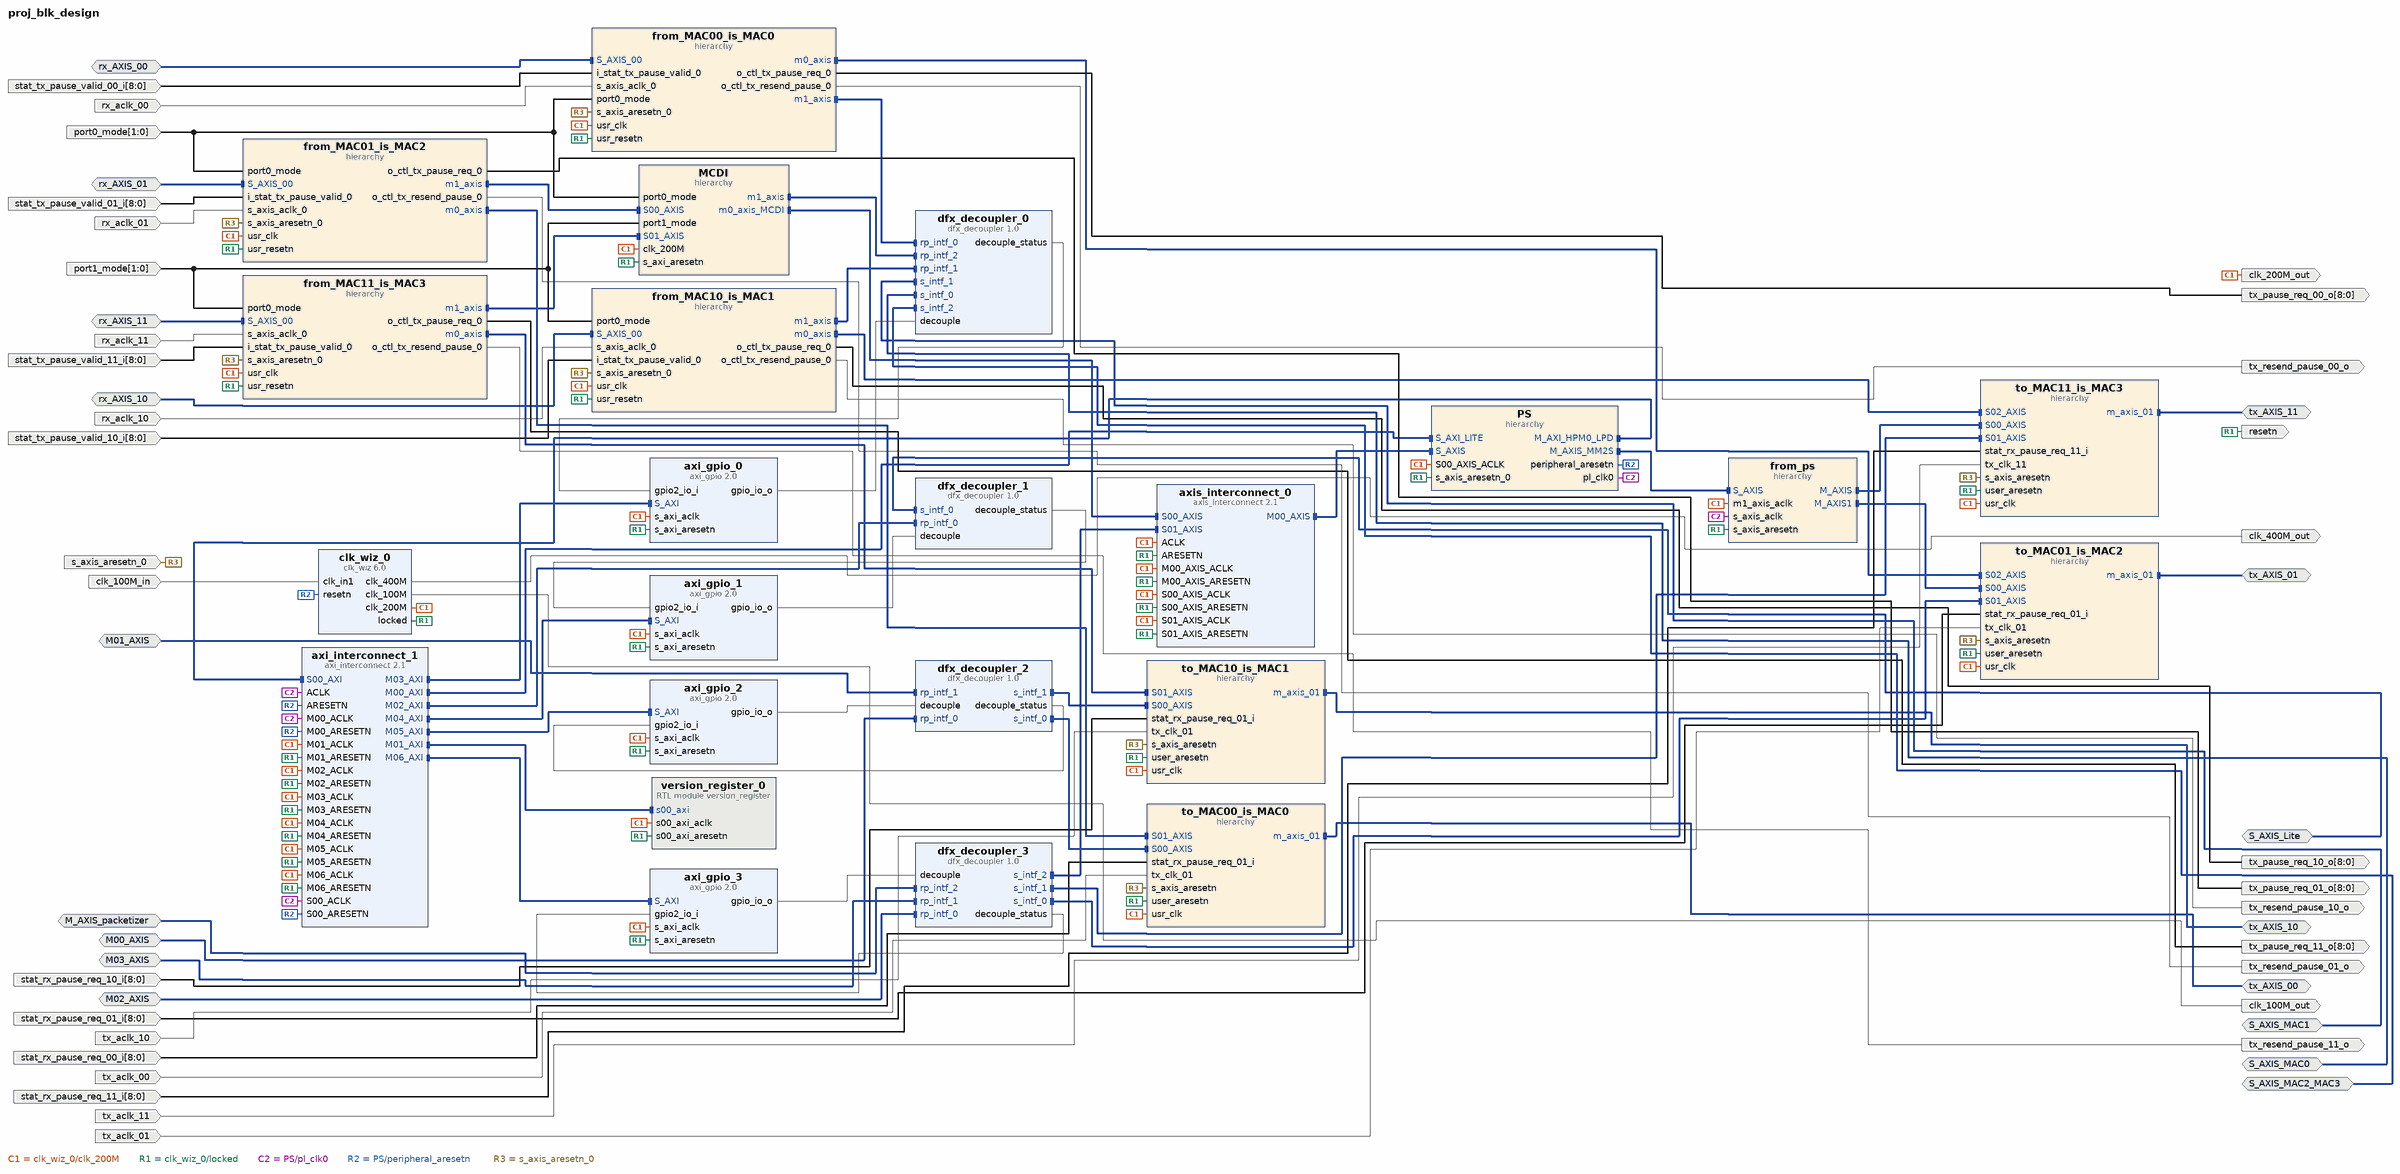
[diagram p0: block diagram of the top level]
# Vivado block design proj_blk_design, xcu25-ffvc1760-2LV-e, Vivado 2020.1_AR75245
create_bd_design proj_blk_design

create_bd_intf_port -mode Slave -vlnv xilinx.com:interface:axis_rtl:1.0 rx_AXIS_00
set_property -dict [list \
  CONFIG.TDATA_NUM_BYTES 8 \
  CONFIG.TDEST_WIDTH 0 \
  CONFIG.TID_WIDTH 0 \
  CONFIG.TUSER_WIDTH 0 \
  CONFIG.HAS_TREADY 1 \
  CONFIG.HAS_TSTRB 0 \
  CONFIG.HAS_TKEEP 1 \
  CONFIG.HAS_TLAST 1 \
  CONFIG.LAYERED_METADATA undef \
] [get_bd_intf_ports rx_AXIS_00]
create_bd_intf_port -mode Slave -vlnv xilinx.com:interface:axis_rtl:1.0 rx_AXIS_01
set_property -dict [list \
  CONFIG.TDATA_NUM_BYTES 8 \
  CONFIG.TDEST_WIDTH 0 \
  CONFIG.TID_WIDTH 0 \
  CONFIG.TUSER_WIDTH 0 \
  CONFIG.HAS_TREADY 1 \
  CONFIG.HAS_TSTRB 0 \
  CONFIG.HAS_TKEEP 1 \
  CONFIG.HAS_TLAST 1 \
  CONFIG.LAYERED_METADATA undef \
] [get_bd_intf_ports rx_AXIS_01]
create_bd_intf_port -mode Slave -vlnv xilinx.com:interface:axis_rtl:1.0 rx_AXIS_10
set_property -dict [list \
  CONFIG.TDATA_NUM_BYTES 8 \
  CONFIG.TDEST_WIDTH 0 \
  CONFIG.TID_WIDTH 0 \
  CONFIG.TUSER_WIDTH 0 \
  CONFIG.HAS_TREADY 1 \
  CONFIG.HAS_TSTRB 0 \
  CONFIG.HAS_TKEEP 1 \
  CONFIG.HAS_TLAST 1 \
  CONFIG.LAYERED_METADATA undef \
] [get_bd_intf_ports rx_AXIS_10]
create_bd_intf_port -mode Slave -vlnv xilinx.com:interface:axis_rtl:1.0 rx_AXIS_11
set_property -dict [list \
  CONFIG.TDATA_NUM_BYTES 8 \
  CONFIG.TDEST_WIDTH 0 \
  CONFIG.TID_WIDTH 0 \
  CONFIG.TUSER_WIDTH 0 \
  CONFIG.HAS_TREADY 1 \
  CONFIG.HAS_TSTRB 0 \
  CONFIG.HAS_TKEEP 1 \
  CONFIG.HAS_TLAST 1 \
  CONFIG.LAYERED_METADATA undef \
] [get_bd_intf_ports rx_AXIS_11]
create_bd_intf_port -mode Master -vlnv xilinx.com:interface:axis_rtl:1.0 tx_AXIS_00
create_bd_intf_port -mode Master -vlnv xilinx.com:interface:axis_rtl:1.0 tx_AXIS_01
create_bd_intf_port -mode Master -vlnv xilinx.com:interface:axis_rtl:1.0 tx_AXIS_10
create_bd_intf_port -mode Master -vlnv xilinx.com:interface:axis_rtl:1.0 tx_AXIS_11
create_bd_intf_port -mode Master -vlnv xilinx.com:interface:axis_rtl:1.0 S_AXIS_MAC0
set_property -dict {CONFIG.FREQ_HZ 200000000 CONFIG.PHASE 0.0} [get_bd_intf_ports S_AXIS_MAC0]
create_bd_intf_port -mode Master -vlnv xilinx.com:interface:axis_rtl:1.0 S_AXIS_MAC1
set_property -dict {CONFIG.FREQ_HZ 200000000 CONFIG.PHASE 0.0} [get_bd_intf_ports S_AXIS_MAC1]
create_bd_intf_port -mode Master -vlnv xilinx.com:interface:axis_rtl:1.0 S_AXIS_MAC2_MAC3
set_property -dict {CONFIG.FREQ_HZ 200000000 CONFIG.PHASE 0.0} [get_bd_intf_ports S_AXIS_MAC2_MAC3]
create_bd_intf_port -mode Master -vlnv xilinx.com:interface:aximm_rtl:1.0 S_AXIS_Lite
set_property -dict [list \
  CONFIG.DATA_WIDTH 32 \
  CONFIG.PROTOCOL AXI4LITE \
  CONFIG.FREQ_HZ 200000000 \
  CONFIG.ADDR_WIDTH 40 \
  CONFIG.HAS_BURST 0 \
  CONFIG.HAS_LOCK 0 \
  CONFIG.HAS_CACHE 0 \
  CONFIG.PHASE 0.0 \
] [get_bd_intf_ports S_AXIS_Lite]
create_bd_intf_port -mode Slave -vlnv xilinx.com:interface:axis_rtl:1.0 M00_AXIS
set_property -dict [list \
  CONFIG.TDATA_NUM_BYTES 64 \
  CONFIG.TDEST_WIDTH 4 \
  CONFIG.TID_WIDTH 0 \
  CONFIG.TUSER_WIDTH 0 \
  CONFIG.HAS_TREADY 1 \
  CONFIG.HAS_TSTRB 0 \
  CONFIG.HAS_TKEEP 1 \
  CONFIG.HAS_TLAST 1 \
  CONFIG.FREQ_HZ 200000000 \
  CONFIG.LAYERED_METADATA undef \
] [get_bd_intf_ports M00_AXIS]
create_bd_intf_port -mode Slave -vlnv xilinx.com:interface:axis_rtl:1.0 M01_AXIS
set_property -dict [list \
  CONFIG.TDATA_NUM_BYTES 64 \
  CONFIG.TDEST_WIDTH 4 \
  CONFIG.TID_WIDTH 0 \
  CONFIG.TUSER_WIDTH 0 \
  CONFIG.HAS_TREADY 1 \
  CONFIG.HAS_TSTRB 0 \
  CONFIG.HAS_TKEEP 1 \
  CONFIG.HAS_TLAST 1 \
  CONFIG.FREQ_HZ 200000000 \
  CONFIG.LAYERED_METADATA undef \
] [get_bd_intf_ports M01_AXIS]
create_bd_intf_port -mode Slave -vlnv xilinx.com:interface:axis_rtl:1.0 M02_AXIS
set_property -dict [list \
  CONFIG.TDATA_NUM_BYTES 64 \
  CONFIG.TDEST_WIDTH 4 \
  CONFIG.TID_WIDTH 0 \
  CONFIG.TUSER_WIDTH 0 \
  CONFIG.HAS_TREADY 1 \
  CONFIG.HAS_TSTRB 0 \
  CONFIG.HAS_TKEEP 1 \
  CONFIG.HAS_TLAST 1 \
  CONFIG.FREQ_HZ 200000000 \
  CONFIG.LAYERED_METADATA undef \
] [get_bd_intf_ports M02_AXIS]
create_bd_intf_port -mode Slave -vlnv xilinx.com:interface:axis_rtl:1.0 M03_AXIS
set_property -dict [list \
  CONFIG.TDATA_NUM_BYTES 64 \
  CONFIG.TDEST_WIDTH 4 \
  CONFIG.TID_WIDTH 0 \
  CONFIG.TUSER_WIDTH 0 \
  CONFIG.HAS_TREADY 1 \
  CONFIG.HAS_TSTRB 0 \
  CONFIG.HAS_TKEEP 1 \
  CONFIG.HAS_TLAST 1 \
  CONFIG.FREQ_HZ 200000000 \
  CONFIG.LAYERED_METADATA undef \
] [get_bd_intf_ports M03_AXIS]
create_bd_intf_port -mode Slave -vlnv xilinx.com:interface:axis_rtl:1.0 M_AXIS_packetizer
set_property -dict [list \
  CONFIG.TDATA_NUM_BYTES 6 \
  CONFIG.TDEST_WIDTH 0 \
  CONFIG.TID_WIDTH 0 \
  CONFIG.TUSER_WIDTH 0 \
  CONFIG.HAS_TREADY 1 \
  CONFIG.HAS_TSTRB 0 \
  CONFIG.HAS_TKEEP 0 \
  CONFIG.HAS_TLAST 0 \
  CONFIG.FREQ_HZ 200000000 \
  CONFIG.LAYERED_METADATA undef \
] [get_bd_intf_ports M_AXIS_packetizer]
create_bd_port -dir I -type clk clk_100M_in
set_property -dict {CONFIG.FREQ_HZ 100000000} [get_bd_ports clk_100M_in]
create_bd_port -dir O -type clk clk_200M_out
set_property -dict {CONFIG.FREQ_HZ 200000000} [get_bd_ports clk_200M_out]
create_bd_port -dir O -type clk clk_400M_out
set_property -dict {CONFIG.FREQ_HZ 400000000} [get_bd_ports clk_400M_out]
create_bd_port -dir I -from 1 -to 0 port0_mode
create_bd_port -dir I -from 1 -to 0 port1_mode
create_bd_port -dir O resetn
create_bd_port -dir I -type clk rx_aclk_00
create_bd_port -dir I -type clk rx_aclk_01
create_bd_port -dir I -type clk rx_aclk_10
create_bd_port -dir I -type clk rx_aclk_11
create_bd_port -dir I -type rst s_axis_aresetn_0
create_bd_port -dir I -from 8 -to 0 stat_rx_pause_req_00_i
create_bd_port -dir I -from 8 -to 0 stat_rx_pause_req_01_i
create_bd_port -dir I -from 8 -to 0 stat_rx_pause_req_10_i
create_bd_port -dir I -from 8 -to 0 stat_rx_pause_req_11_i
create_bd_port -dir I -from 8 -to 0 stat_tx_pause_valid_00_i
create_bd_port -dir I -from 8 -to 0 stat_tx_pause_valid_01_i
create_bd_port -dir I -from 8 -to 0 stat_tx_pause_valid_10_i
create_bd_port -dir I -from 8 -to 0 stat_tx_pause_valid_11_i
create_bd_port -dir I -type clk tx_aclk_00
create_bd_port -dir I -type clk tx_aclk_01
set_property -dict {CONFIG.ASSOCIATED_BUSIF tx_AXIS_01} [get_bd_ports tx_aclk_01]
create_bd_port -dir I -type clk tx_aclk_10
create_bd_port -dir I -type clk tx_aclk_11
set_property -dict {CONFIG.ASSOCIATED_BUSIF tx_AXIS_11} [get_bd_ports tx_aclk_11]
create_bd_port -dir O -from 8 -to 0 tx_pause_req_00_o
create_bd_port -dir O -from 8 -to 0 tx_pause_req_01_o
create_bd_port -dir O -from 8 -to 0 tx_pause_req_10_o
create_bd_port -dir O -from 8 -to 0 tx_pause_req_11_o
create_bd_port -dir O tx_resend_pause_00_o
create_bd_port -dir O tx_resend_pause_01_o
create_bd_port -dir O tx_resend_pause_10_o
create_bd_port -dir O tx_resend_pause_11_o
create_bd_port -dir O -type clk clk_100M_out

create_bd_cell -type hier MCDI
create_bd_cell -type hier PS
create_bd_cell -type ip -vlnv xilinx.com:ip:axi_gpio:2.0 axi_gpio_0
set_property -dict [list \
  CONFIG.C_ALL_INPUTS_2 1 \
  CONFIG.C_ALL_OUTPUTS 1 \
  CONFIG.C_GPIO2_WIDTH 1 \
  CONFIG.C_GPIO_WIDTH 1 \
  CONFIG.C_IS_DUAL 1 \
] [get_bd_cells axi_gpio_0]
create_bd_cell -type ip -vlnv xilinx.com:ip:axi_gpio:2.0 axi_gpio_1
set_property -dict [list \
  CONFIG.C_ALL_INPUTS_2 1 \
  CONFIG.C_ALL_OUTPUTS 1 \
  CONFIG.C_GPIO2_WIDTH 1 \
  CONFIG.C_GPIO_WIDTH 1 \
  CONFIG.C_IS_DUAL 1 \
] [get_bd_cells axi_gpio_1]
create_bd_cell -type ip -vlnv xilinx.com:ip:axi_gpio:2.0 axi_gpio_2
set_property -dict [list \
  CONFIG.C_ALL_INPUTS_2 1 \
  CONFIG.C_ALL_OUTPUTS 1 \
  CONFIG.C_GPIO2_WIDTH 1 \
  CONFIG.C_GPIO_WIDTH 1 \
  CONFIG.C_IS_DUAL 1 \
] [get_bd_cells axi_gpio_2]
create_bd_cell -type ip -vlnv xilinx.com:ip:axi_gpio:2.0 axi_gpio_3
set_property -dict [list \
  CONFIG.C_ALL_INPUTS_2 1 \
  CONFIG.C_ALL_OUTPUTS 1 \
  CONFIG.C_GPIO2_WIDTH 1 \
  CONFIG.C_GPIO_WIDTH 1 \
  CONFIG.C_IS_DUAL 1 \
] [get_bd_cells axi_gpio_3]
create_bd_cell -type ip -vlnv xilinx.com:ip:axi_interconnect:2.1 axi_interconnect_1
set_property -dict [list \
  CONFIG.M00_HAS_REGSLICE 4 \
  CONFIG.M01_HAS_REGSLICE 4 \
  CONFIG.M02_HAS_REGSLICE 4 \
  CONFIG.M03_HAS_REGSLICE 4 \
  CONFIG.M04_HAS_REGSLICE 4 \
  CONFIG.M05_HAS_REGSLICE 4 \
  CONFIG.M06_HAS_REGSLICE 4 \
  CONFIG.M07_HAS_REGSLICE 4 \
  CONFIG.M08_HAS_REGSLICE 4 \
  CONFIG.M09_HAS_REGSLICE 4 \
  CONFIG.M10_HAS_REGSLICE 4 \
  CONFIG.M11_HAS_REGSLICE 4 \
  CONFIG.M12_HAS_REGSLICE 4 \
  CONFIG.M13_HAS_REGSLICE 4 \
  CONFIG.M14_HAS_REGSLICE 4 \
  CONFIG.NUM_MI 7 \
  CONFIG.S00_HAS_REGSLICE 4 \
] [get_bd_cells axi_interconnect_1]
create_bd_cell -type ip -vlnv xilinx.com:ip:axis_interconnect:2.1 axis_interconnect_0
set_property -dict [list \
  CONFIG.ARB_ALGORITHM 3 \
  CONFIG.ARB_ON_MAX_XFERS 0 \
  CONFIG.ARB_ON_TLAST 1 \
  CONFIG.M00_AXIS_HIGHTDEST 0x000000ff \
  CONFIG.M00_HAS_REGSLICE 1 \
  CONFIG.NUM_MI 1 \
  CONFIG.NUM_SI 2 \
  CONFIG.S00_FIFO_DEPTH 64 \
  CONFIG.S00_FIFO_MODE 1 \
  CONFIG.S00_HAS_REGSLICE 1 \
  CONFIG.S01_FIFO_DEPTH 64 \
  CONFIG.S01_FIFO_MODE 1 \
  CONFIG.S01_HAS_REGSLICE 1 \
] [get_bd_cells axis_interconnect_0]
create_bd_cell -type ip -vlnv xilinx.com:ip:clk_wiz:6.0 clk_wiz_0
set_property -dict [list \
  CONFIG.CLKIN1_JITTER_PS 100.0 \
  CONFIG.CLKOUT1_DRIVES Buffer \
  CONFIG.CLKOUT1_JITTER 102.086 \
  CONFIG.CLKOUT1_PHASE_ERROR 87.180 \
  CONFIG.CLKOUT1_REQUESTED_OUT_FREQ 200 \
  CONFIG.CLKOUT2_DRIVES Buffer \
  CONFIG.CLKOUT2_JITTER 115.831 \
  CONFIG.CLKOUT2_PHASE_ERROR 87.180 \
  CONFIG.CLKOUT2_USED true \
  CONFIG.CLKOUT3_DRIVES Buffer \
  CONFIG.CLKOUT3_JITTER 90.074 \
  CONFIG.CLKOUT3_PHASE_ERROR 87.180 \
  CONFIG.CLKOUT3_REQUESTED_OUT_FREQ 400.000 \
  CONFIG.CLKOUT3_USED true \
  CONFIG.CLKOUT4_DRIVES Buffer \
  CONFIG.CLKOUT5_DRIVES Buffer \
  CONFIG.CLKOUT6_DRIVES Buffer \
  CONFIG.CLKOUT7_DRIVES Buffer \
  CONFIG.CLK_OUT1_PORT clk_200M \
  CONFIG.CLK_OUT2_PORT clk_100M \
  CONFIG.CLK_OUT3_PORT clk_400M \
  CONFIG.FEEDBACK_SOURCE FDBK_AUTO \
  CONFIG.MMCM_BANDWIDTH OPTIMIZED \
  CONFIG.MMCM_CLKFBOUT_MULT_F 12.000 \
  CONFIG.MMCM_CLKIN1_PERIOD 10.000 \
  CONFIG.MMCM_CLKIN2_PERIOD 10.000 \
  CONFIG.MMCM_CLKOUT0_DIVIDE_F 6.000 \
  CONFIG.MMCM_CLKOUT1_DIVIDE 12 \
  CONFIG.MMCM_CLKOUT2_DIVIDE 3 \
  CONFIG.MMCM_COMPENSATION AUTO \
  CONFIG.MMCM_DIVCLK_DIVIDE 1 \
  CONFIG.NUM_OUT_CLKS 3 \
  CONFIG.PRIMITIVE MMCM \
  CONFIG.PRIM_IN_FREQ 100.000 \
  CONFIG.PRIM_SOURCE Global_buffer \
  CONFIG.RESET_PORT resetn \
  CONFIG.RESET_TYPE ACTIVE_LOW \
] [get_bd_cells clk_wiz_0]
create_bd_cell -type ip -vlnv xilinx.com:ip:dfx_decoupler:1.0 dfx_decoupler_0
set_property -dict [list \
  CONFIG.ALL_PARAMS {INTF {intf_0 {ID 0 VLNV xilinx.com:interface:axis_rtl:1.0 SIGNALS {TVALID {PRESENT 1 WIDTH 1} TREADY {PRESENT 1 WIDTH 1} TDATA {PRESENT 1 WIDTH 512} TUSER {PRESENT 0 WIDTH 0} TLAST {PRESENT 1 WIDTH 1} TID {PRESENT 0 WIDTH 0} TDEST {PRESENT 1 WIDTH 2} TSTRB {PRESENT 0 WIDTH 64} TKEEP {PRESENT 1 WIDTH 64}}} intf_1 {ID 1 VLNV xilinx.com:interface:axis_rtl:1.0 SIGNALS {TVALID {PRESENT 1 WIDTH 1} TREADY {PRESENT 1 WIDTH 1} TDATA {PRESENT 1 WIDTH 512} TUSER {PRESENT 0 WIDTH 0} TLAST {PRESENT 1 WIDTH 1} TID {PRESENT 0 WIDTH 0} TDEST {PRESENT 1 WIDTH 2} TSTRB {PRESENT 0 WIDTH 64} TKEEP {PRESENT 1 WIDTH 64}}} intf_2 {ID 2 VLNV xilinx.com:interface:axis_rtl:1.0 SIGNALS {TVALID {PRESENT 1 WIDTH 1} TREADY {PRESENT 1 WIDTH 1} TDATA {PRESENT 1 WIDTH 512} TUSER {PRESENT 0 WIDTH 0} TLAST {PRESENT 1 WIDTH 1} TID {PRESENT 0 WIDTH 0} TDEST {PRESENT 1 WIDTH 2} TSTRB {PRESENT 0 WIDTH 64} TKEEP {PRESENT 1 WIDTH 64}}}} IPI_PROP_COUNT 0} \
  CONFIG.GUI_INTERFACE_NAME intf_0 \
  CONFIG.GUI_SELECT_INTERFACE 0 \
  CONFIG.GUI_SELECT_VLNV xilinx.com:interface:axis_rtl:1.0 \
  CONFIG.GUI_SIGNAL_DECOUPLED_0 true \
  CONFIG.GUI_SIGNAL_DECOUPLED_1 true \
  CONFIG.GUI_SIGNAL_SELECT_0 TVALID \
  CONFIG.GUI_SIGNAL_SELECT_1 TREADY \
  CONFIG.GUI_SIGNAL_SELECT_2 TDATA \
  CONFIG.GUI_SIGNAL_SELECT_3 TUSER \
  CONFIG.GUI_SIGNAL_SELECT_4 TLAST \
  CONFIG.GUI_SIGNAL_SELECT_5 TID \
  CONFIG.GUI_SIGNAL_SELECT_6 TDEST \
  CONFIG.GUI_SIGNAL_SELECT_7 TSTRB \
  CONFIG.GUI_SIGNAL_SELECT_8 TKEEP \
] [get_bd_cells dfx_decoupler_0]
create_bd_cell -type ip -vlnv xilinx.com:ip:dfx_decoupler:1.0 dfx_decoupler_1
set_property -dict [list \
  CONFIG.ALL_PARAMS {INTF {intf_0 {ID 0 VLNV xilinx.com:interface:aximm_rtl:1.0 PROTOCOL axi4lite SIGNALS {ARVALID {PRESENT 1 WIDTH 1} ARREADY {PRESENT 1 WIDTH 1} AWVALID {PRESENT 1 WIDTH 1} AWREADY {PRESENT 1 WIDTH 1} BVALID {PRESENT 1 WIDTH 1} BREADY {PRESENT 1 WIDTH 1} RVALID {PRESENT 1 WIDTH 1} RREADY {PRESENT 1 WIDTH 1} WVALID {PRESENT 1 WIDTH 1} WREADY {PRESENT 1 WIDTH 1} AWADDR {PRESENT 1 WIDTH 40} AWLEN {PRESENT 0 WIDTH 8} AWSIZE {PRESENT 0 WIDTH 3} AWBURST {PRESENT 0 WIDTH 2} AWLOCK {PRESENT 0 WIDTH 1} AWCACHE {PRESENT 0 WIDTH 4} AWPROT {PRESENT 1 WIDTH 3} WDATA {PRESENT 1 WIDTH 32} WSTRB {PRESENT 1 WIDTH 4} WLAST {PRESENT 0 WIDTH 1} BRESP {PRESENT 1 WIDTH 2} ARADDR {PRESENT 1 WIDTH 40} ARLEN {PRESENT 0 WIDTH 8} ARSIZE {PRESENT 0 WIDTH 3} ARBURST {PRESENT 0 WIDTH 2} ARLOCK {PRESENT 0 WIDTH 1} ARCACHE {PRESENT 0 WIDTH 4} ARPROT {PRESENT 1 WIDTH 3} RDATA {PRESENT 1 WIDTH 32} RRESP {PRESENT 1 WIDTH 2} RLAST {PRESENT 0 WIDTH 1} AWID {PRESENT 0 WIDTH 0} AWREGION {PRESENT 1 WIDTH 4} AWQOS {PRESENT 1 WIDTH 4} AWUSER {PRESENT 0 WIDTH 0} WID {PRESENT 0 WIDTH 0} WUSER {PRESENT 0 WIDTH 0} BID {PRESENT 0 WIDTH 0} BUSER {PRESENT 0 WIDTH 0} ARID {PRESENT 0 WIDTH 0} ARREGION {PRESENT 1 WIDTH 4} ARQOS {PRESENT 1 WIDTH 4} ARUSER {PRESENT 0 WIDTH 0} RID {PRESENT 0 WIDTH 0} RUSER {PRESENT 0 WIDTH 0}}}} IPI_PROP_COUNT 26} \
  CONFIG.GUI_INTERFACE_NAME intf_0 \
  CONFIG.GUI_INTERFACE_PROTOCOL axi4lite \
  CONFIG.GUI_SELECT_INTERFACE 0 \
  CONFIG.GUI_SELECT_VLNV xilinx.com:interface:aximm_rtl:1.0 \
  CONFIG.GUI_SIGNAL_DECOUPLED_0 true \
  CONFIG.GUI_SIGNAL_DECOUPLED_1 true \
  CONFIG.GUI_SIGNAL_DECOUPLED_2 true \
  CONFIG.GUI_SIGNAL_DECOUPLED_3 true \
  CONFIG.GUI_SIGNAL_DECOUPLED_4 true \
  CONFIG.GUI_SIGNAL_DECOUPLED_5 true \
  CONFIG.GUI_SIGNAL_DECOUPLED_6 true \
  CONFIG.GUI_SIGNAL_DECOUPLED_7 true \
  CONFIG.GUI_SIGNAL_DECOUPLED_8 true \
  CONFIG.GUI_SIGNAL_DECOUPLED_9 true \
  CONFIG.GUI_SIGNAL_SELECT_0 ARVALID \
  CONFIG.GUI_SIGNAL_SELECT_1 ARREADY \
  CONFIG.GUI_SIGNAL_SELECT_2 AWVALID \
  CONFIG.GUI_SIGNAL_SELECT_3 AWREADY \
  CONFIG.GUI_SIGNAL_SELECT_4 BVALID \
  CONFIG.GUI_SIGNAL_SELECT_5 BREADY \
  CONFIG.GUI_SIGNAL_SELECT_6 RVALID \
  CONFIG.GUI_SIGNAL_SELECT_7 RREADY \
  CONFIG.GUI_SIGNAL_SELECT_8 WVALID \
  CONFIG.GUI_SIGNAL_SELECT_9 WREADY \
] [get_bd_cells dfx_decoupler_1]
create_bd_cell -type ip -vlnv xilinx.com:ip:dfx_decoupler:1.0 dfx_decoupler_2
set_property -dict [list \
  CONFIG.ALL_PARAMS {INTF {intf_0 {ID 0 VLNV xilinx.com:interface:axis_rtl:1.0 SIGNALS {TVALID {PRESENT 1 WIDTH 1} TREADY {PRESENT 1 WIDTH 1} TDATA {PRESENT 1 WIDTH 512} TUSER {PRESENT 0 WIDTH 0} TLAST {PRESENT 1 WIDTH 1} TID {PRESENT 0 WIDTH 0} TDEST {PRESENT 1 WIDTH 4} TSTRB {PRESENT 0 WIDTH 64} TKEEP {PRESENT 1 WIDTH 64}}} intf_1 {ID 1 VLNV xilinx.com:interface:axis_rtl:1.0 SIGNALS {TVALID {PRESENT 1 WIDTH 1} TREADY {PRESENT 1 WIDTH 1} TDATA {PRESENT 1 WIDTH 512} TUSER {PRESENT 0 WIDTH 0} TLAST {PRESENT 1 WIDTH 1} TID {PRESENT 0 WIDTH 0} TDEST {PRESENT 1 WIDTH 4} TSTRB {PRESENT 0 WIDTH 64} TKEEP {PRESENT 1 WIDTH 64}}}} IPI_PROP_COUNT 0} \
  CONFIG.GUI_INTERFACE_NAME intf_0 \
  CONFIG.GUI_SELECT_INTERFACE 0 \
  CONFIG.GUI_SELECT_VLNV xilinx.com:interface:axis_rtl:1.0 \
  CONFIG.GUI_SIGNAL_DECOUPLED_0 true \
  CONFIG.GUI_SIGNAL_DECOUPLED_1 true \
  CONFIG.GUI_SIGNAL_SELECT_0 TVALID \
  CONFIG.GUI_SIGNAL_SELECT_1 TREADY \
  CONFIG.GUI_SIGNAL_SELECT_2 TDATA \
  CONFIG.GUI_SIGNAL_SELECT_3 TUSER \
  CONFIG.GUI_SIGNAL_SELECT_4 TLAST \
  CONFIG.GUI_SIGNAL_SELECT_5 TID \
  CONFIG.GUI_SIGNAL_SELECT_6 TDEST \
  CONFIG.GUI_SIGNAL_SELECT_7 TSTRB \
  CONFIG.GUI_SIGNAL_SELECT_8 TKEEP \
] [get_bd_cells dfx_decoupler_2]
create_bd_cell -type ip -vlnv xilinx.com:ip:dfx_decoupler:1.0 dfx_decoupler_3
set_property -dict [list \
  CONFIG.ALL_PARAMS {INTF {intf_0 {ID 0 VLNV xilinx.com:interface:axis_rtl:1.0 SIGNALS {TVALID {PRESENT 1 WIDTH 1} TREADY {PRESENT 1 WIDTH 1} TDATA {PRESENT 1 WIDTH 512} TUSER {PRESENT 0 WIDTH 0} TLAST {PRESENT 1 WIDTH 1} TID {PRESENT 0 WIDTH 0} TDEST {PRESENT 1 WIDTH 4} TSTRB {PRESENT 0 WIDTH 64} TKEEP {PRESENT 1 WIDTH 64}}} intf_1 {ID 1 VLNV xilinx.com:interface:axis_rtl:1.0 SIGNALS {TVALID {PRESENT 1 WIDTH 1} TREADY {PRESENT 1 WIDTH 1} TDATA {PRESENT 1 WIDTH 512} TUSER {PRESENT 0 WIDTH 0} TLAST {PRESENT 1 WIDTH 1} TID {PRESENT 0 WIDTH 0} TDEST {PRESENT 1 WIDTH 4} TSTRB {PRESENT 0 WIDTH 64} TKEEP {PRESENT 1 WIDTH 64}}} intf_2 {ID 2 VLNV xilinx.com:interface:axis_rtl:1.0 SIGNALS {TVALID {PRESENT 1 WIDTH 1} TREADY {PRESENT 1 WIDTH 1} TDATA {PRESENT 1 WIDTH 48} TUSER {PRESENT 0 WIDTH 0} TLAST {PRESENT 0 WIDTH 1} TID {PRESENT 0 WIDTH 0} TDEST {PRESENT 0 WIDTH 0} TSTRB {PRESENT 0 WIDTH 6} TKEEP {PRESENT 0 WIDTH 6}}}} IPI_PROP_COUNT 0} \
  CONFIG.GUI_INTERFACE_NAME intf_0 \
  CONFIG.GUI_SELECT_INTERFACE 0 \
  CONFIG.GUI_SELECT_VLNV xilinx.com:interface:axis_rtl:1.0 \
  CONFIG.GUI_SIGNAL_DECOUPLED_0 true \
  CONFIG.GUI_SIGNAL_DECOUPLED_1 true \
  CONFIG.GUI_SIGNAL_SELECT_0 TVALID \
  CONFIG.GUI_SIGNAL_SELECT_1 TREADY \
  CONFIG.GUI_SIGNAL_SELECT_2 TDATA \
  CONFIG.GUI_SIGNAL_SELECT_3 TUSER \
  CONFIG.GUI_SIGNAL_SELECT_4 TLAST \
  CONFIG.GUI_SIGNAL_SELECT_5 TID \
  CONFIG.GUI_SIGNAL_SELECT_6 TDEST \
  CONFIG.GUI_SIGNAL_SELECT_7 TSTRB \
  CONFIG.GUI_SIGNAL_SELECT_8 TKEEP \
] [get_bd_cells dfx_decoupler_3]
create_bd_cell -type hier from_MAC00_is_MAC0
create_bd_cell -type hier from_ps
create_bd_cell -type hier to_MAC00_is_MAC0
create_bd_cell -type hier to_MAC01_is_MAC2
create_bd_cell -type hier to_MAC11_is_MAC3
create_bd_cell -type hier to_MAC10_is_MAC1
create_bd_cell -type hier from_MAC10_is_MAC1
create_bd_cell -type hier from_MAC01_is_MAC2
create_bd_cell -type hier from_MAC11_is_MAC3
create_bd_cell -type module -reference version_register version_register_0

# ---- hierarchy /MCDI ----
current_bd_instance /MCDI
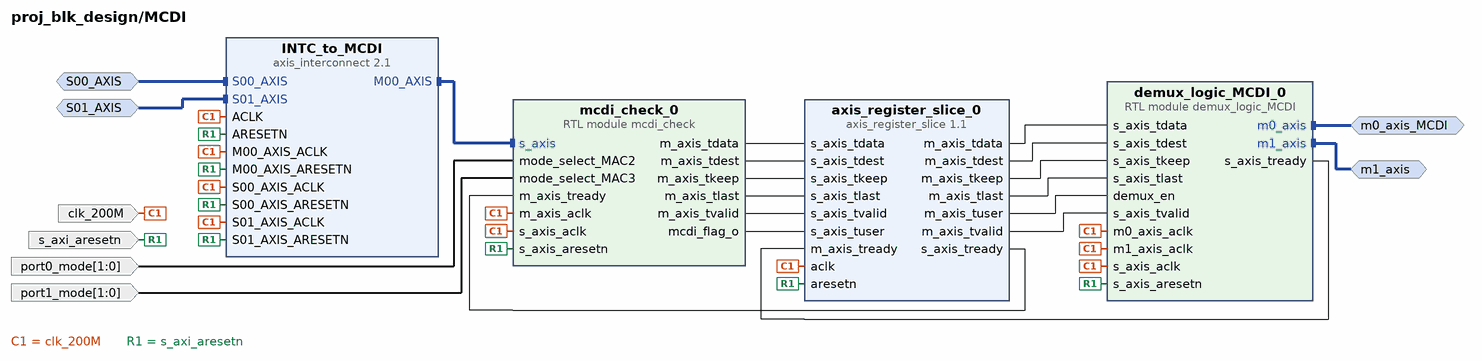
[diagram p1: block diagram inside /MCDI]
create_bd_intf_pin -mode Slave -vlnv xilinx.com:interface:axis_rtl:1.0 S00_AXIS
create_bd_intf_pin -mode Slave -vlnv xilinx.com:interface:axis_rtl:1.0 S01_AXIS
create_bd_intf_pin -mode Master -vlnv xilinx.com:interface:axis_rtl:1.0 m0_axis_MCDI
create_bd_intf_pin -mode Master -vlnv xilinx.com:interface:axis_rtl:1.0 m1_axis
create_bd_pin -dir I -type clk clk_200M
create_bd_pin -dir I -from 1 -to 0 port0_mode
create_bd_pin -dir I -from 1 -to 0 port1_mode
create_bd_pin -dir I -type rst s_axi_aresetn

create_bd_cell -type ip -vlnv xilinx.com:ip:axis_interconnect:2.1 INTC_to_MCDI
set_property -dict [list \
  CONFIG.ARB_ALGORITHM 3 \
  CONFIG.ARB_ON_MAX_XFERS 0 \
  CONFIG.ARB_ON_TLAST 1 \
  CONFIG.M00_AXIS_HIGHTDEST 0x000000ff \
  CONFIG.M00_FIFO_DEPTH 0 \
  CONFIG.M00_HAS_REGSLICE 0 \
  CONFIG.NUM_MI 1 \
  CONFIG.NUM_SI 2 \
  CONFIG.S00_FIFO_DEPTH 32 \
  CONFIG.S00_FIFO_MODE 1 \
  CONFIG.S00_HAS_REGSLICE 1 \
  CONFIG.S01_FIFO_DEPTH 32 \
  CONFIG.S01_FIFO_MODE 1 \
  CONFIG.S01_HAS_REGSLICE 1 \
] [get_bd_cells INTC_to_MCDI]
create_bd_cell -type ip -vlnv xilinx.com:ip:axis_register_slice:1.1 axis_register_slice_0
set_property -dict [list \
  CONFIG.HAS_TKEEP 1 \
  CONFIG.HAS_TLAST 1 \
  CONFIG.HAS_TREADY 1 \
  CONFIG.TDATA_NUM_BYTES 64 \
  CONFIG.TDEST_WIDTH 2 \
  CONFIG.TUSER_WIDTH 1 \
] [get_bd_cells axis_register_slice_0]
create_bd_cell -type module -reference demux_logic_MCDI demux_logic_MCDI_0
set_property -dict {CONFIG.TDATA_WIDTH 512 CONFIG.TDEST_SIZE 2 CONFIG.TKEEP_WIDTH 64} [get_bd_cells demux_logic_MCDI_0]
create_bd_cell -type module -reference mcdi_check mcdi_check_0

# ---- hierarchy /PS ----
current_bd_instance /PS
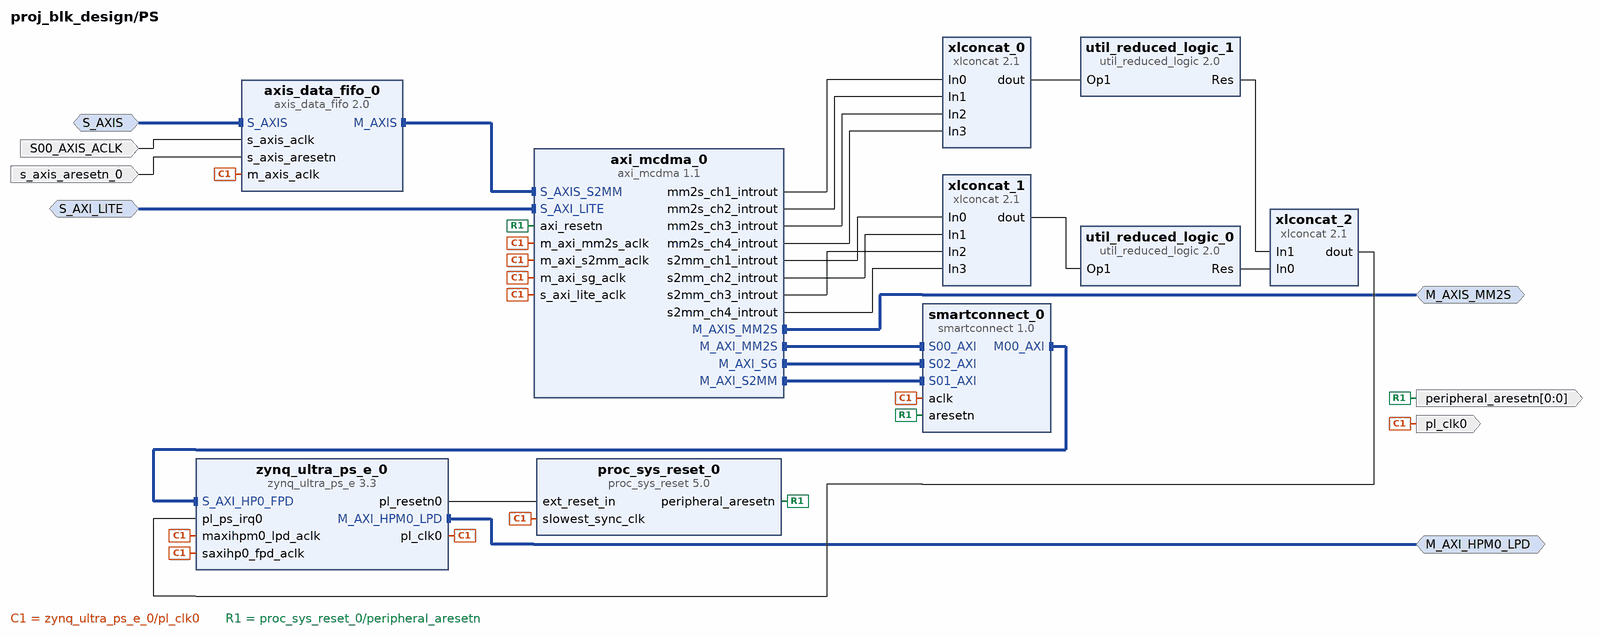
[diagram p2: block diagram inside /PS]
create_bd_intf_pin -mode Master -vlnv xilinx.com:interface:aximm_rtl:1.0 M_AXI_HPM0_LPD
create_bd_intf_pin -mode Slave -vlnv xilinx.com:interface:aximm_rtl:1.0 S_AXI_LITE
create_bd_intf_pin -mode Master -vlnv xilinx.com:interface:axis_rtl:1.0 M_AXIS_MM2S
create_bd_intf_pin -mode Slave -vlnv xilinx.com:interface:axis_rtl:1.0 S_AXIS
create_bd_pin -dir I -type clk S00_AXIS_ACLK
create_bd_pin -dir O -from 0 -to 0 -type rst peripheral_aresetn
create_bd_pin -dir O -type clk pl_clk0
create_bd_pin -dir I -type rst s_axis_aresetn_0

create_bd_cell -type ip -vlnv xilinx.com:ip:axi_mcdma:1.1 axi_mcdma_0
set_property -dict [list \
  CONFIG.c_group1_mm2s 0000000000001111 \
  CONFIG.c_group1_s2mm 0000000000001111 \
  CONFIG.c_m_axi_mm2s_data_width 512 \
  CONFIG.c_m_axi_s2mm_data_width 512 \
  CONFIG.c_m_axis_mm2s_tdata_width 512 \
  CONFIG.c_mm2s_burst_size 16 \
  CONFIG.c_num_mm2s_channels 4 \
  CONFIG.c_num_s2mm_channels 4 \
  CONFIG.c_prmry_is_aclk_async 1 \
] [get_bd_cells axi_mcdma_0]
create_bd_cell -type ip -vlnv xilinx.com:ip:proc_sys_reset:5.0 proc_sys_reset_0
create_bd_cell -type ip -vlnv xilinx.com:ip:smartconnect:1.0 smartconnect_0
set_property -dict {CONFIG.NUM_SI 3} [get_bd_cells smartconnect_0]
create_bd_cell -type ip -vlnv xilinx.com:ip:util_reduced_logic:2.0 util_reduced_logic_0
set_property -dict {CONFIG.C_OPERATION or CONFIG.C_SIZE 4} [get_bd_cells util_reduced_logic_0]
create_bd_cell -type ip -vlnv xilinx.com:ip:util_reduced_logic:2.0 util_reduced_logic_1
set_property -dict {CONFIG.C_OPERATION or CONFIG.C_SIZE 4} [get_bd_cells util_reduced_logic_1]
create_bd_cell -type ip -vlnv xilinx.com:ip:xlconcat:2.1 xlconcat_0
set_property -dict {CONFIG.NUM_PORTS 4} [get_bd_cells xlconcat_0]
create_bd_cell -type ip -vlnv xilinx.com:ip:xlconcat:2.1 xlconcat_1
set_property -dict {CONFIG.NUM_PORTS 4} [get_bd_cells xlconcat_1]
create_bd_cell -type ip -vlnv xilinx.com:ip:xlconcat:2.1 xlconcat_2
set_property -dict {CONFIG.NUM_PORTS 2} [get_bd_cells xlconcat_2]
create_bd_cell -type ip -vlnv xilinx.com:ip:zynq_ultra_ps_e:3.3 zynq_ultra_ps_e_0
set_property -dict [list \
  CONFIG.CAN0_BOARD_INTERFACE custom \
  CONFIG.CAN1_BOARD_INTERFACE custom \
  CONFIG.CSU_BOARD_INTERFACE custom \
  CONFIG.DP_BOARD_INTERFACE custom \
  CONFIG.GEM0_BOARD_INTERFACE custom \
  CONFIG.GEM1_BOARD_INTERFACE custom \
  CONFIG.GEM2_BOARD_INTERFACE custom \
  CONFIG.GEM3_BOARD_INTERFACE custom \
  CONFIG.GPIO_BOARD_INTERFACE custom \
  CONFIG.IIC0_BOARD_INTERFACE custom \
  CONFIG.IIC1_BOARD_INTERFACE custom \
  CONFIG.NAND_BOARD_INTERFACE custom \
  CONFIG.PCIE_BOARD_INTERFACE custom \
  CONFIG.PJTAG_BOARD_INTERFACE custom \
  CONFIG.PMU_BOARD_INTERFACE custom \
  CONFIG.PSU_BANK_0_IO_STANDARD LVCMOS33 \
  CONFIG.PSU_BANK_1_IO_STANDARD LVCMOS33 \
  CONFIG.PSU_BANK_2_IO_STANDARD LVCMOS33 \
  CONFIG.PSU_BANK_3_IO_STANDARD LVCMOS33 \
  CONFIG.PSU_USB3__DUAL_CLOCK_ENABLE 0 \
  CONFIG.PSU__CAN1__PERIPHERAL__ENABLE 0 \
  CONFIG.PSU__CRF_APB__ACPU_CTRL__FREQMHZ 1333.333 \
  CONFIG.PSU__CRF_APB__ACPU_CTRL__SRCSEL APLL \
  CONFIG.PSU__CRF_APB__APLL_CTRL__SRCSEL PSS_REF_CLK \
  CONFIG.PSU__CRF_APB__DBG_FPD_CTRL__FREQMHZ 250 \
  CONFIG.PSU__CRF_APB__DBG_FPD_CTRL__SRCSEL IOPLL \
  CONFIG.PSU__CRF_APB__DBG_TRACE_CTRL__FREQMHZ 250 \
  CONFIG.PSU__CRF_APB__DBG_TRACE_CTRL__SRCSEL IOPLL \
  CONFIG.PSU__CRF_APB__DBG_TSTMP_CTRL__FREQMHZ 250 \
  CONFIG.PSU__CRF_APB__DBG_TSTMP_CTRL__SRCSEL IOPLL \
  CONFIG.PSU__CRF_APB__DDR_CTRL__FREQMHZ 1200 \
  CONFIG.PSU__CRF_APB__DDR_CTRL__SRCSEL DPLL \
  CONFIG.PSU__CRF_APB__DPDMA_REF_CTRL__FREQMHZ 600 \
  CONFIG.PSU__CRF_APB__DPDMA_REF_CTRL__SRCSEL DPLL \
  CONFIG.PSU__CRF_APB__DPLL_CTRL__SRCSEL PSS_REF_CLK \
  CONFIG.PSU__CRF_APB__DP_AUDIO_REF_CTRL__SRCSEL VPLL \
  CONFIG.PSU__CRF_APB__DP_STC_REF_CTRL__SRCSEL VPLL \
  CONFIG.PSU__CRF_APB__DP_VIDEO_REF_CTRL__SRCSEL DPLL \
  CONFIG.PSU__CRF_APB__GDMA_REF_CTRL__FREQMHZ 600 \
  CONFIG.PSU__CRF_APB__GDMA_REF_CTRL__SRCSEL DPLL \
  CONFIG.PSU__CRF_APB__GPU_REF_CTRL__FREQMHZ 600 \
  CONFIG.PSU__CRF_APB__GPU_REF_CTRL__SRCSEL DPLL \
  CONFIG.PSU__CRF_APB__TOPSW_LSBUS_CTRL__FREQMHZ 100 \
  CONFIG.PSU__CRF_APB__TOPSW_LSBUS_CTRL__SRCSEL IOPLL \
  CONFIG.PSU__CRF_APB__TOPSW_MAIN_CTRL__FREQMHZ 533.333 \
  CONFIG.PSU__CRF_APB__TOPSW_MAIN_CTRL__SRCSEL VPLL \
  CONFIG.PSU__CRF_APB__VPLL_CTRL__SRCSEL PSS_REF_CLK \
  CONFIG.PSU__CRL_APB__ADMA_REF_CTRL__FREQMHZ 533.333 \
  CONFIG.PSU__CRL_APB__ADMA_REF_CTRL__SRCSEL RPLL \
  CONFIG.PSU__CRL_APB__CAN1_REF_CTRL__FREQMHZ 100 \
  CONFIG.PSU__CRL_APB__CAN1_REF_CTRL__SRCSEL IOPLL \
  CONFIG.PSU__CRL_APB__CPU_R5_CTRL__FREQMHZ 533.333 \
  CONFIG.PSU__CRL_APB__CPU_R5_CTRL__SRCSEL RPLL \
  CONFIG.PSU__CRL_APB__DBG_LPD_CTRL__FREQMHZ 250 \
  CONFIG.PSU__CRL_APB__DBG_LPD_CTRL__SRCSEL IOPLL \
  CONFIG.PSU__CRL_APB__GEM3_REF_CTRL__FREQMHZ 125 \
  CONFIG.PSU__CRL_APB__GEM3_REF_CTRL__SRCSEL IOPLL \
  CONFIG.PSU__CRL_APB__I2C0_REF_CTRL__FREQMHZ 100 \
  CONFIG.PSU__CRL_APB__I2C0_REF_CTRL__SRCSEL IOPLL \
  CONFIG.PSU__CRL_APB__I2C1_REF_CTRL__FREQMHZ 100 \
  CONFIG.PSU__CRL_APB__I2C1_REF_CTRL__SRCSEL IOPLL \
  CONFIG.PSU__CRL_APB__IOPLL_CTRL__SRCSEL PSS_REF_CLK \
  CONFIG.PSU__CRL_APB__IOU_SWITCH_CTRL__FREQMHZ 267 \
  CONFIG.PSU__CRL_APB__IOU_SWITCH_CTRL__SRCSEL RPLL \
  CONFIG.PSU__CRL_APB__LPD_LSBUS_CTRL__FREQMHZ 100 \
  CONFIG.PSU__CRL_APB__LPD_LSBUS_CTRL__SRCSEL IOPLL \
  CONFIG.PSU__CRL_APB__LPD_SWITCH_CTRL__FREQMHZ 533.333 \
  CONFIG.PSU__CRL_APB__LPD_SWITCH_CTRL__SRCSEL RPLL \
  CONFIG.PSU__CRL_APB__PCAP_CTRL__FREQMHZ 200 \
  CONFIG.PSU__CRL_APB__PCAP_CTRL__SRCSEL IOPLL \
  CONFIG.PSU__CRL_APB__PL0_REF_CTRL__FREQMHZ 100 \
  CONFIG.PSU__CRL_APB__PL0_REF_CTRL__SRCSEL RPLL \
  CONFIG.PSU__CRL_APB__QSPI_REF_CTRL__FREQMHZ 300 \
  CONFIG.PSU__CRL_APB__QSPI_REF_CTRL__SRCSEL IOPLL \
  CONFIG.PSU__CRL_APB__RPLL_CTRL__SRCSEL PSS_REF_CLK \
  CONFIG.PSU__CRL_APB__SDIO1_REF_CTRL__FREQMHZ 200 \
  CONFIG.PSU__CRL_APB__SDIO1_REF_CTRL__SRCSEL RPLL \
  CONFIG.PSU__CRL_APB__TIMESTAMP_REF_CTRL__FREQMHZ 100 \
  CONFIG.PSU__CRL_APB__TIMESTAMP_REF_CTRL__SRCSEL PSS_REF_CLK \
  CONFIG.PSU__CRL_APB__UART0_REF_CTRL__FREQMHZ 100 \
  CONFIG.PSU__CRL_APB__UART0_REF_CTRL__SRCSEL IOPLL \
  CONFIG.PSU__CRL_APB__UART1_REF_CTRL__FREQMHZ 100 \
  CONFIG.PSU__CRL_APB__UART1_REF_CTRL__SRCSEL IOPLL \
  CONFIG.PSU__CRL_APB__USB0_BUS_REF_CTRL__FREQMHZ 250 \
  CONFIG.PSU__CRL_APB__USB0_BUS_REF_CTRL__SRCSEL IOPLL \
  CONFIG.PSU__CRL_APB__USB3_DUAL_REF_CTRL__FREQMHZ 20 \
  CONFIG.PSU__CRL_APB__USB3_DUAL_REF_CTRL__SRCSEL IOPLL \
  CONFIG.PSU__CRL_APB__USB3__ENABLE 0 \
  CONFIG.PSU__CSUPMU__PERIPHERAL__VALID 0 \
  CONFIG.PSU__DDRC__BUS_WIDTH {64 Bit} \
  CONFIG.PSU__DDRC__COMPONENTS Components \
  CONFIG.PSU__DDRC__DEVICE_CAPACITY {8192 MBits} \
  CONFIG.PSU__DDRC__DRAM_WIDTH {16 Bits} \
  CONFIG.PSU__DDRC__ECC Disabled \
  CONFIG.PSU__DDRC__MEMORY_TYPE {DDR 4} \
  CONFIG.PSU__DDRC__SPEED_BIN DDR4_2400R \
  CONFIG.PSU__DDR_HIGH_ADDRESS_GUI_ENABLE 1 \
  CONFIG.PSU__DDR__INTERFACE__FREQMHZ 600.000 \
  CONFIG.PSU__DEVICE_TYPE EV \
  CONFIG.PSU__DISPLAYPORT__PERIPHERAL__ENABLE 0 \
  CONFIG.PSU__DLL__ISUSED 0 \
  CONFIG.PSU__ENET3__PERIPHERAL__ENABLE 0 \
  CONFIG.PSU__FPD_SLCR__WDT1__FREQMHZ 100 \
  CONFIG.PSU__FPGA_PL0_ENABLE 1 \
  CONFIG.PSU__GPIO0_MIO__PERIPHERAL__ENABLE 0 \
  CONFIG.PSU__GPIO1_MIO__PERIPHERAL__ENABLE 0 \
  CONFIG.PSU__I2C0__PERIPHERAL__ENABLE 0 \
  CONFIG.PSU__I2C1__PERIPHERAL__ENABLE 0 \
  CONFIG.PSU__IOU_SLCR__IOU_TTC_APB_CLK__TTC0_SEL APB \
  CONFIG.PSU__IOU_SLCR__IOU_TTC_APB_CLK__TTC1_SEL APB \
  CONFIG.PSU__IOU_SLCR__IOU_TTC_APB_CLK__TTC2_SEL APB \
  CONFIG.PSU__IOU_SLCR__IOU_TTC_APB_CLK__TTC3_SEL APB \
  CONFIG.PSU__IOU_SLCR__TTC0__FREQMHZ 100 \
  CONFIG.PSU__IOU_SLCR__TTC1__FREQMHZ 100 \
  CONFIG.PSU__IOU_SLCR__TTC2__FREQMHZ 100 \
  CONFIG.PSU__IOU_SLCR__TTC3__FREQMHZ 100 \
  CONFIG.PSU__IOU_SLCR__WDT0__FREQMHZ 100 \
  CONFIG.PSU__LPD_SLCR__CSUPMU__FREQMHZ 100 \
  CONFIG.PSU__OVERRIDE_HPX_QOS 0 \
  CONFIG.PSU__OVERRIDE__BASIC_CLOCK 0 \
  CONFIG.PSU__PMU__PERIPHERAL__ENABLE 0 \
  CONFIG.PSU__PRESET_APPLIED 0 \
  CONFIG.PSU__PSS_REF_CLK__FREQMHZ 33.333 \
  CONFIG.PSU__QSPI_COHERENCY 0 \
  CONFIG.PSU__QSPI_ROUTE_THROUGH_FPD 0 \
  CONFIG.PSU__QSPI__GRP_FBCLK__ENABLE 1 \
  CONFIG.PSU__QSPI__GRP_FBCLK__IO {MIO 6} \
  CONFIG.PSU__QSPI__PERIPHERAL__DATA_MODE x4 \
  CONFIG.PSU__QSPI__PERIPHERAL__ENABLE 1 \
  CONFIG.PSU__QSPI__PERIPHERAL__IO {MIO 0 .. 5} \
  CONFIG.PSU__QSPI__PERIPHERAL__MODE Single \
  CONFIG.PSU__SATA__PERIPHERAL__ENABLE 0 \
  CONFIG.PSU__SD1__PERIPHERAL__ENABLE 0 \
  CONFIG.PSU__SWDT0__PERIPHERAL__ENABLE 0 \
  CONFIG.PSU__SWDT1__PERIPHERAL__ENABLE 0 \
  CONFIG.PSU__TTC0__PERIPHERAL__ENABLE 0 \
  CONFIG.PSU__TTC1__PERIPHERAL__ENABLE 0 \
  CONFIG.PSU__TTC2__PERIPHERAL__ENABLE 0 \
  CONFIG.PSU__TTC3__PERIPHERAL__ENABLE 0 \
  CONFIG.PSU__UART0__BAUD_RATE 115200 \
  CONFIG.PSU__UART0__MODEM__ENABLE 0 \
  CONFIG.PSU__UART0__PERIPHERAL__ENABLE 1 \
  CONFIG.PSU__UART0__PERIPHERAL__IO {MIO 22 .. 23} \
  CONFIG.PSU__UART1__PERIPHERAL__ENABLE 0 \
  CONFIG.PSU__USB0__PERIPHERAL__ENABLE 0 \
  CONFIG.PSU__USE__IRQ0 1 \
  CONFIG.PSU__USE__M_AXI_GP0 0 \
  CONFIG.PSU__USE__M_AXI_GP1 0 \
  CONFIG.PSU__USE__M_AXI_GP2 1 \
  CONFIG.PSU__USE__S_AXI_GP2 1 \
  CONFIG.QSPI_BOARD_INTERFACE custom \
  CONFIG.SATA_BOARD_INTERFACE custom \
  CONFIG.SD0_BOARD_INTERFACE custom \
  CONFIG.SD1_BOARD_INTERFACE custom \
  CONFIG.SPI0_BOARD_INTERFACE custom \
  CONFIG.SPI1_BOARD_INTERFACE custom \
  CONFIG.SUBPRESET1 Custom \
  CONFIG.SUBPRESET2 Custom \
  CONFIG.SWDT0_BOARD_INTERFACE custom \
  CONFIG.SWDT1_BOARD_INTERFACE custom \
  CONFIG.TRACE_BOARD_INTERFACE custom \
  CONFIG.TTC0_BOARD_INTERFACE custom \
  CONFIG.TTC1_BOARD_INTERFACE custom \
  CONFIG.TTC2_BOARD_INTERFACE custom \
  CONFIG.TTC3_BOARD_INTERFACE custom \
  CONFIG.UART0_BOARD_INTERFACE custom \
  CONFIG.UART1_BOARD_INTERFACE custom \
  CONFIG.USB0_BOARD_INTERFACE custom \
  CONFIG.USB1_BOARD_INTERFACE custom \
] [get_bd_cells zynq_ultra_ps_e_0]
# 745 more settings of zynq_ultra_ps_e_0 are not shown: defaults, MIO pin electricals, DDR timing, and values the tool derives
create_bd_cell -type ip -vlnv xilinx.com:ip:axis_data_fifo:2.0 axis_data_fifo_0
set_property -dict [list \
  CONFIG.FIFO_DEPTH 128 \
  CONFIG.FIFO_MODE 2 \
  CONFIG.HAS_TKEEP 1 \
  CONFIG.IS_ACLK_ASYNC 1 \
  CONFIG.TDATA_NUM_BYTES 64 \
  CONFIG.TDEST_WIDTH 4 \
  CONFIG.TID_WIDTH 8 \
] [get_bd_cells axis_data_fifo_0]

# ---- hierarchy /from_MAC00_is_MAC0 ----
current_bd_instance /from_MAC00_is_MAC0
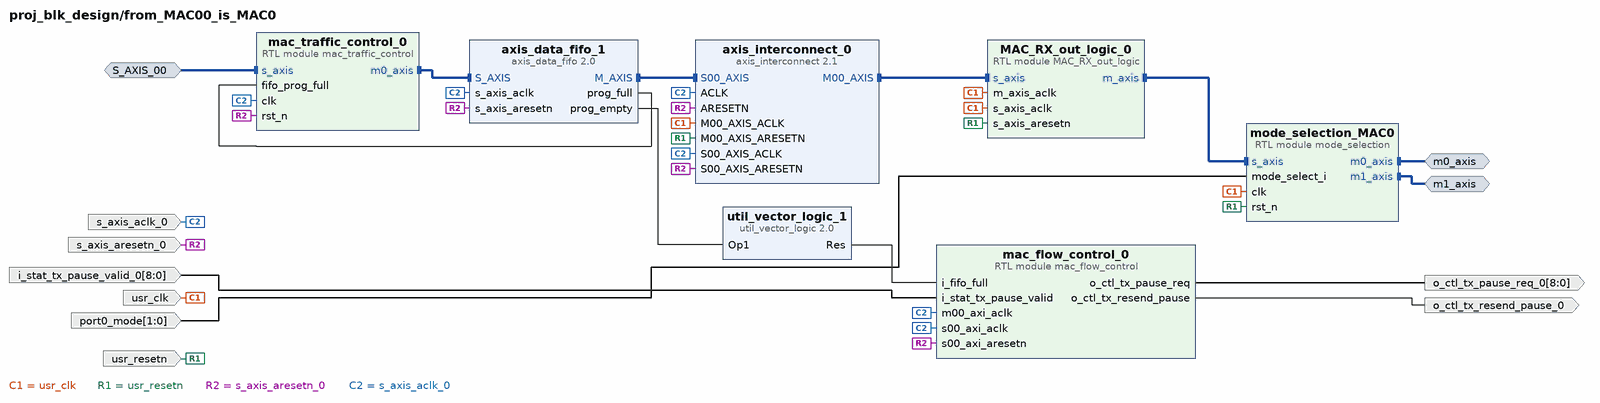
[diagram p3: block diagram inside /from_MAC00_is_MAC0]
create_bd_intf_pin -mode Slave -vlnv xilinx.com:interface:axis_rtl:1.0 S_AXIS_00
create_bd_intf_pin -mode Master -vlnv xilinx.com:interface:axis_rtl:1.0 m1_axis
create_bd_intf_pin -mode Master -vlnv xilinx.com:interface:axis_rtl:1.0 m0_axis
create_bd_pin -dir I -type clk usr_clk
create_bd_pin -dir I -type rst usr_resetn
create_bd_pin -dir I -from 8 -to 0 i_stat_tx_pause_valid_0
create_bd_pin -dir O -from 8 -to 0 o_ctl_tx_pause_req_0
create_bd_pin -dir O o_ctl_tx_resend_pause_0
create_bd_pin -dir I -type rst s_axis_aresetn_0
create_bd_pin -dir I -type clk s_axis_aclk_0
create_bd_pin -dir I -from 1 -to 0 port0_mode

create_bd_cell -type ip -vlnv xilinx.com:ip:axis_data_fifo:2.0 axis_data_fifo_1
set_property -dict [list \
  CONFIG.FIFO_DEPTH 1024 \
  CONFIG.FIFO_MODE 2 \
  CONFIG.HAS_PROG_EMPTY 1 \
  CONFIG.HAS_PROG_FULL 1 \
  CONFIG.HAS_TKEEP 1 \
  CONFIG.PROG_EMPTY_THRESH 300 \
  CONFIG.PROG_FULL_THRESH 800 \
  CONFIG.TDATA_NUM_BYTES 8 \
  CONFIG.TDEST_WIDTH 0 \
] [get_bd_cells axis_data_fifo_1]
create_bd_cell -type ip -vlnv xilinx.com:ip:util_vector_logic:2.0 util_vector_logic_1
set_property -dict {CONFIG.C_OPERATION not CONFIG.C_SIZE 1} [get_bd_cells util_vector_logic_1]
create_bd_cell -type ip -vlnv xilinx.com:ip:axis_interconnect:2.1 axis_interconnect_0
set_property -dict [list \
  CONFIG.ARB_ON_TLAST 1 \
  CONFIG.M00_AXIS_HIGHTDEST 0x00000003 \
  CONFIG.M00_FIFO_DEPTH 32 \
  CONFIG.M00_FIFO_MODE 0 \
  CONFIG.M00_HAS_REGSLICE 1 \
  CONFIG.NUM_MI 1 \
  CONFIG.S00_FIFO_DEPTH 256 \
  CONFIG.S00_FIFO_MODE 1 \
  CONFIG.S00_HAS_REGSLICE 1 \
] [get_bd_cells axis_interconnect_0]
create_bd_cell -type module -reference mac_traffic_control mac_traffic_control_0
create_bd_cell -type module -reference MAC_RX_out_logic MAC_RX_out_logic_0
set_property -dict {CONFIG.TDEST_VALUE {"00"}} [get_bd_cells MAC_RX_out_logic_0]
create_bd_cell -type module -reference mac_flow_control mac_flow_control_0
create_bd_cell -type module -reference mode_selection mode_selection_MAC0

# ---- hierarchy /from_ps ----
current_bd_instance /from_ps
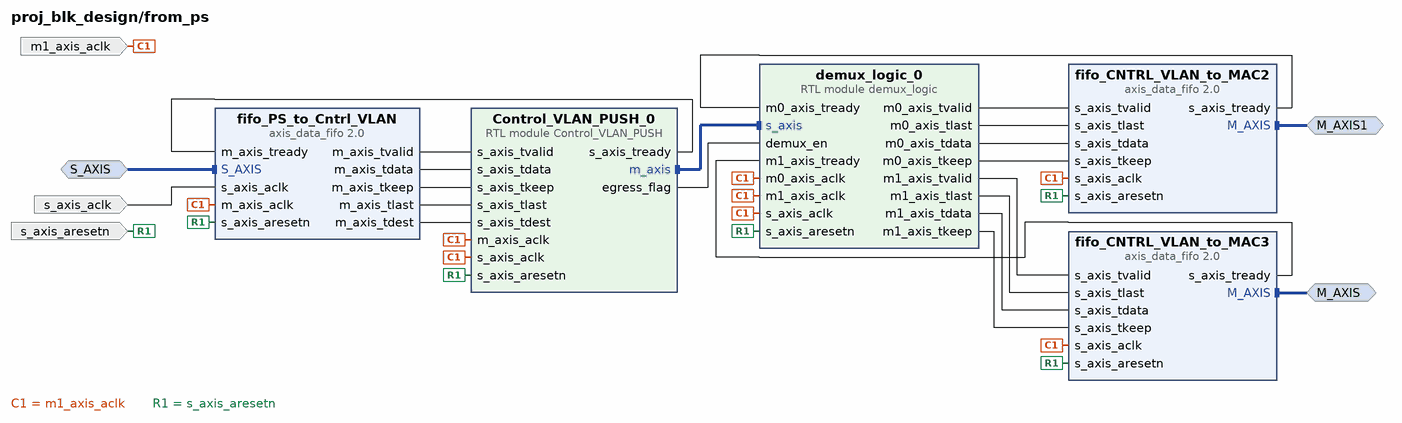
[diagram p4: block diagram inside /from_ps]
create_bd_intf_pin -mode Slave -vlnv xilinx.com:interface:axis_rtl:1.0 S_AXIS
create_bd_intf_pin -mode Master -vlnv xilinx.com:interface:axis_rtl:1.0 M_AXIS
create_bd_intf_pin -mode Master -vlnv xilinx.com:interface:axis_rtl:1.0 M_AXIS1
create_bd_pin -dir I -type clk m1_axis_aclk
create_bd_pin -dir I -type rst s_axis_aresetn
create_bd_pin -dir I -type clk s_axis_aclk

create_bd_cell -type module -reference demux_logic demux_logic_0
set_property -dict {CONFIG.TDATA_WIDTH 512 CONFIG.TDEST_SIZE 4 CONFIG.TKEEP_WIDTH 64} [get_bd_cells demux_logic_0]
create_bd_cell -type ip -vlnv xilinx.com:ip:axis_data_fifo:2.0 fifo_PS_to_Cntrl_VLAN
set_property -dict [list \
  CONFIG.FIFO_DEPTH 64 \
  CONFIG.FIFO_MODE 2 \
  CONFIG.HAS_TKEEP 1 \
  CONFIG.IS_ACLK_ASYNC 1 \
  CONFIG.TDATA_NUM_BYTES 64 \
  CONFIG.TDEST_WIDTH 4 \
  CONFIG.TID_WIDTH 8 \
  CONFIG.TUSER_WIDTH 16 \
] [get_bd_cells fifo_PS_to_Cntrl_VLAN]
create_bd_cell -type ip -vlnv xilinx.com:ip:axis_data_fifo:2.0 fifo_CNTRL_VLAN_to_MAC3
set_property -dict [list \
  CONFIG.FIFO_DEPTH 64 \
  CONFIG.FIFO_MODE 2 \
  CONFIG.HAS_TKEEP 1 \
  CONFIG.TDATA_NUM_BYTES 64 \
] [get_bd_cells fifo_CNTRL_VLAN_to_MAC3]
create_bd_cell -type module -reference Control_VLAN_PUSH Control_VLAN_PUSH_0
create_bd_cell -type ip -vlnv xilinx.com:ip:axis_data_fifo:2.0 fifo_CNTRL_VLAN_to_MAC2
set_property -dict [list \
  CONFIG.FIFO_DEPTH 64 \
  CONFIG.FIFO_MODE 2 \
  CONFIG.HAS_TKEEP 1 \
  CONFIG.TDATA_NUM_BYTES 64 \
] [get_bd_cells fifo_CNTRL_VLAN_to_MAC2]

# ---- hierarchy /to_MAC00_is_MAC0 ----
current_bd_instance /to_MAC00_is_MAC0
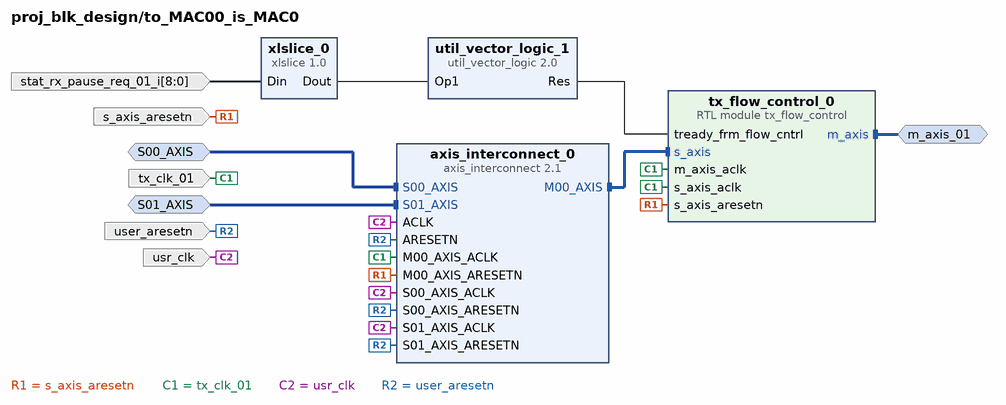
[diagram p5: block diagram inside /to_MAC00_is_MAC0]
create_bd_intf_pin -mode Master -vlnv xilinx.com:interface:axis_rtl:1.0 m_axis_01
create_bd_intf_pin -mode Slave -vlnv xilinx.com:interface:axis_rtl:1.0 S00_AXIS
create_bd_intf_pin -mode Slave -vlnv xilinx.com:interface:axis_rtl:1.0 S01_AXIS
create_bd_pin -dir I -type clk tx_clk_01
create_bd_pin -dir I -from 8 -to 0 stat_rx_pause_req_01_i
create_bd_pin -dir I -type clk usr_clk
create_bd_pin -dir I -type rst user_aresetn
create_bd_pin -dir I -type rst s_axis_aresetn

create_bd_cell -type module -reference tx_flow_control tx_flow_control_0
create_bd_cell -type ip -vlnv xilinx.com:ip:xlslice:1.0 xlslice_0
set_property -dict {CONFIG.DIN_FROM 8 CONFIG.DIN_TO 8 CONFIG.DIN_WIDTH 9 CONFIG.DOUT_WIDTH 1} [get_bd_cells xlslice_0]
create_bd_cell -type ip -vlnv xilinx.com:ip:util_vector_logic:2.0 util_vector_logic_1
set_property -dict {CONFIG.C_OPERATION not CONFIG.C_SIZE 1} [get_bd_cells util_vector_logic_1]
create_bd_cell -type ip -vlnv xilinx.com:ip:axis_interconnect:2.1 axis_interconnect_0
set_property -dict [list \
  CONFIG.ARB_ALGORITHM 3 \
  CONFIG.ARB_ON_MAX_XFERS 0 \
  CONFIG.ARB_ON_TLAST 1 \
  CONFIG.M00_AXIS_HIGHTDEST 0x00000003 \
  CONFIG.M00_FIFO_DEPTH 256 \
  CONFIG.M00_FIFO_MODE 1 \
  CONFIG.M00_HAS_REGSLICE 1 \
  CONFIG.M01_AXIS_BASETDEST 0x00000000 \
  CONFIG.M01_FIFO_DEPTH 512 \
  CONFIG.M01_FIFO_MODE 1 \
  CONFIG.M01_HAS_REGSLICE 1 \
  CONFIG.NUM_MI 1 \
  CONFIG.NUM_SI 2 \
  CONFIG.S00_FIFO_DEPTH 64 \
  CONFIG.S00_FIFO_MODE 1 \
  CONFIG.S00_HAS_REGSLICE 1 \
  CONFIG.S01_FIFO_DEPTH 64 \
  CONFIG.S01_FIFO_MODE 1 \
  CONFIG.S01_HAS_REGSLICE 1 \
  CONFIG.S02_FIFO_DEPTH 512 \
  CONFIG.S02_FIFO_MODE 1 \
  CONFIG.S02_HAS_REGSLICE 1 \
] [get_bd_cells axis_interconnect_0]

# ---- hierarchy /to_MAC01_is_MAC2 ----
current_bd_instance /to_MAC01_is_MAC2
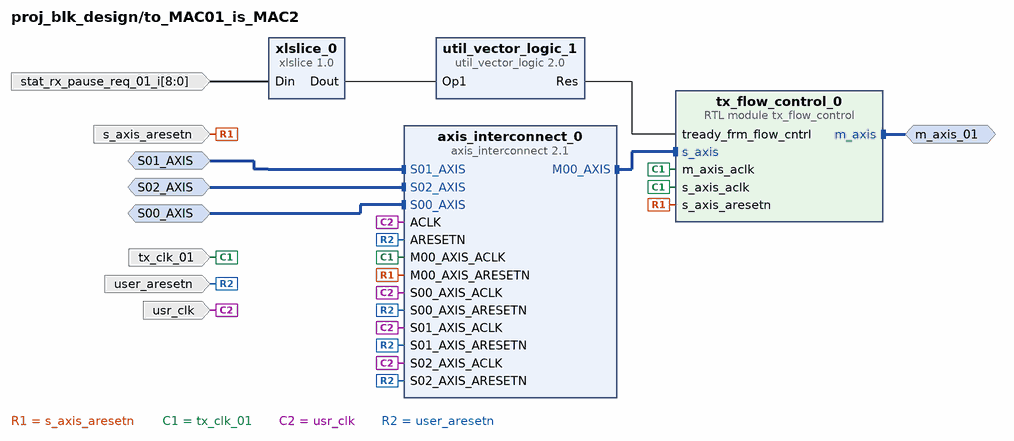
[diagram p6: block diagram inside /to_MAC01_is_MAC2]
create_bd_intf_pin -mode Master -vlnv xilinx.com:interface:axis_rtl:1.0 m_axis_01
create_bd_intf_pin -mode Slave -vlnv xilinx.com:interface:axis_rtl:1.0 S00_AXIS
create_bd_intf_pin -mode Slave -vlnv xilinx.com:interface:axis_rtl:1.0 S01_AXIS
create_bd_intf_pin -mode Slave -vlnv xilinx.com:interface:axis_rtl:1.0 S02_AXIS
create_bd_pin -dir I -type clk tx_clk_01
create_bd_pin -dir I -from 8 -to 0 stat_rx_pause_req_01_i
create_bd_pin -dir I -type clk usr_clk
create_bd_pin -dir I -type rst user_aresetn
create_bd_pin -dir I -type rst s_axis_aresetn

create_bd_cell -type module -reference tx_flow_control tx_flow_control_0
create_bd_cell -type ip -vlnv xilinx.com:ip:xlslice:1.0 xlslice_0
set_property -dict {CONFIG.DIN_FROM 8 CONFIG.DIN_TO 8 CONFIG.DIN_WIDTH 9 CONFIG.DOUT_WIDTH 1} [get_bd_cells xlslice_0]
create_bd_cell -type ip -vlnv xilinx.com:ip:util_vector_logic:2.0 util_vector_logic_1
set_property -dict {CONFIG.C_OPERATION not CONFIG.C_SIZE 1} [get_bd_cells util_vector_logic_1]
create_bd_cell -type ip -vlnv xilinx.com:ip:axis_interconnect:2.1 axis_interconnect_0
set_property -dict [list \
  CONFIG.ARB_ALGORITHM 3 \
  CONFIG.ARB_ON_MAX_XFERS 0 \
  CONFIG.ARB_ON_TLAST 1 \
  CONFIG.M00_AXIS_HIGHTDEST 0x00000003 \
  CONFIG.M00_FIFO_DEPTH 256 \
  CONFIG.M00_FIFO_MODE 1 \
  CONFIG.M00_HAS_REGSLICE 0 \
  CONFIG.M01_AXIS_BASETDEST 0x00000000 \
  CONFIG.M01_FIFO_DEPTH 512 \
  CONFIG.M01_FIFO_MODE 1 \
  CONFIG.M01_HAS_REGSLICE 1 \
  CONFIG.NUM_MI 1 \
  CONFIG.NUM_SI 3 \
  CONFIG.S00_FIFO_DEPTH 64 \
  CONFIG.S00_FIFO_MODE 1 \
  CONFIG.S00_HAS_REGSLICE 1 \
  CONFIG.S01_FIFO_DEPTH 64 \
  CONFIG.S01_FIFO_MODE 1 \
  CONFIG.S01_HAS_REGSLICE 1 \
  CONFIG.S02_FIFO_DEPTH 64 \
  CONFIG.S02_FIFO_MODE 1 \
  CONFIG.S02_HAS_REGSLICE 1 \
] [get_bd_cells axis_interconnect_0]

# ---- hierarchy /to_MAC11_is_MAC3 ----
current_bd_instance /to_MAC11_is_MAC3
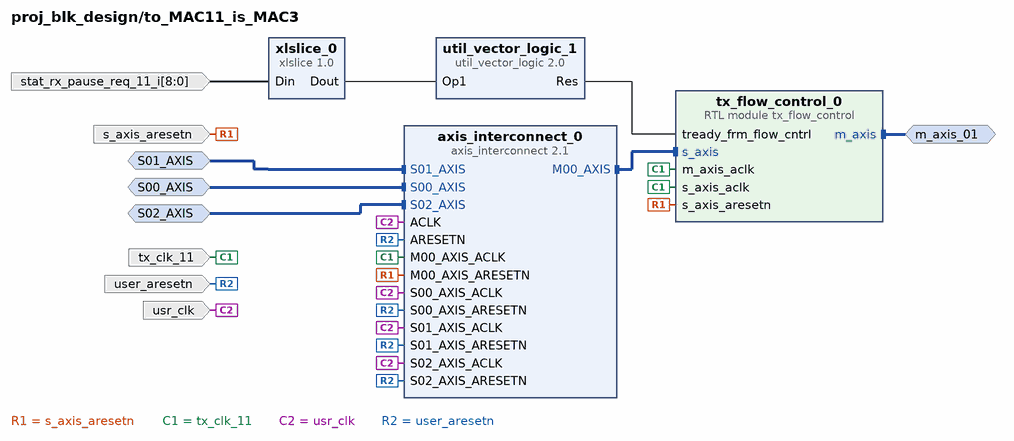
[diagram p7: block diagram inside /to_MAC11_is_MAC3]
create_bd_intf_pin -mode Master -vlnv xilinx.com:interface:axis_rtl:1.0 m_axis_01
create_bd_intf_pin -mode Slave -vlnv xilinx.com:interface:axis_rtl:1.0 S00_AXIS
create_bd_intf_pin -mode Slave -vlnv xilinx.com:interface:axis_rtl:1.0 S01_AXIS
create_bd_intf_pin -mode Slave -vlnv xilinx.com:interface:axis_rtl:1.0 S02_AXIS
create_bd_pin -dir I -type clk tx_clk_11
create_bd_pin -dir I -from 8 -to 0 stat_rx_pause_req_11_i
create_bd_pin -dir I -type clk usr_clk
create_bd_pin -dir I -type rst user_aresetn
create_bd_pin -dir I -type rst s_axis_aresetn

create_bd_cell -type module -reference tx_flow_control tx_flow_control_0
create_bd_cell -type ip -vlnv xilinx.com:ip:xlslice:1.0 xlslice_0
set_property -dict {CONFIG.DIN_FROM 8 CONFIG.DIN_TO 8 CONFIG.DIN_WIDTH 9 CONFIG.DOUT_WIDTH 1} [get_bd_cells xlslice_0]
create_bd_cell -type ip -vlnv xilinx.com:ip:util_vector_logic:2.0 util_vector_logic_1
set_property -dict {CONFIG.C_OPERATION not CONFIG.C_SIZE 1} [get_bd_cells util_vector_logic_1]
create_bd_cell -type ip -vlnv xilinx.com:ip:axis_interconnect:2.1 axis_interconnect_0
set_property -dict [list \
  CONFIG.ARB_ALGORITHM 3 \
  CONFIG.ARB_ON_MAX_XFERS 0 \
  CONFIG.ARB_ON_TLAST 1 \
  CONFIG.M00_AXIS_HIGHTDEST 0x00000003 \
  CONFIG.M00_FIFO_DEPTH 256 \
  CONFIG.M00_FIFO_MODE 1 \
  CONFIG.M00_HAS_REGSLICE 1 \
  CONFIG.M01_AXIS_BASETDEST 0x00000000 \
  CONFIG.M01_FIFO_DEPTH 512 \
  CONFIG.M01_FIFO_MODE 1 \
  CONFIG.M01_HAS_REGSLICE 1 \
  CONFIG.NUM_MI 1 \
  CONFIG.NUM_SI 3 \
  CONFIG.S00_FIFO_DEPTH 64 \
  CONFIG.S00_FIFO_MODE 1 \
  CONFIG.S00_HAS_REGSLICE 1 \
  CONFIG.S01_FIFO_DEPTH 64 \
  CONFIG.S01_FIFO_MODE 1 \
  CONFIG.S01_HAS_REGSLICE 1 \
  CONFIG.S02_FIFO_DEPTH 64 \
  CONFIG.S02_FIFO_MODE 1 \
  CONFIG.S02_HAS_REGSLICE 1 \
] [get_bd_cells axis_interconnect_0]

# ---- hierarchy /to_MAC10_is_MAC1 ----
current_bd_instance /to_MAC10_is_MAC1
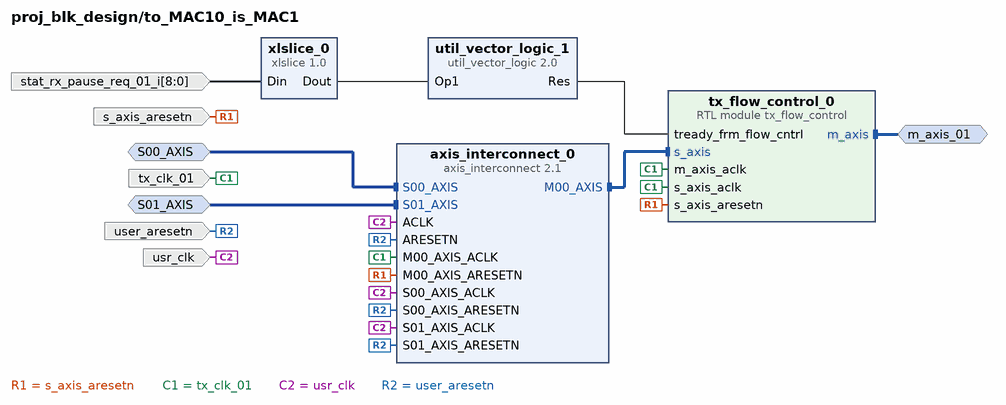
[diagram p8: block diagram inside /to_MAC10_is_MAC1]
create_bd_intf_pin -mode Master -vlnv xilinx.com:interface:axis_rtl:1.0 m_axis_01
create_bd_intf_pin -mode Slave -vlnv xilinx.com:interface:axis_rtl:1.0 S00_AXIS
create_bd_intf_pin -mode Slave -vlnv xilinx.com:interface:axis_rtl:1.0 S01_AXIS
create_bd_pin -dir I -type clk tx_clk_01
create_bd_pin -dir I -from 8 -to 0 stat_rx_pause_req_01_i
create_bd_pin -dir I -type clk usr_clk
create_bd_pin -dir I -type rst user_aresetn
create_bd_pin -dir I -type rst s_axis_aresetn

create_bd_cell -type module -reference tx_flow_control tx_flow_control_0
create_bd_cell -type ip -vlnv xilinx.com:ip:xlslice:1.0 xlslice_0
set_property -dict {CONFIG.DIN_FROM 8 CONFIG.DIN_TO 8 CONFIG.DIN_WIDTH 9 CONFIG.DOUT_WIDTH 1} [get_bd_cells xlslice_0]
create_bd_cell -type ip -vlnv xilinx.com:ip:util_vector_logic:2.0 util_vector_logic_1
set_property -dict {CONFIG.C_OPERATION not CONFIG.C_SIZE 1} [get_bd_cells util_vector_logic_1]
create_bd_cell -type ip -vlnv xilinx.com:ip:axis_interconnect:2.1 axis_interconnect_0
set_property -dict [list \
  CONFIG.ARB_ALGORITHM 3 \
  CONFIG.ARB_ON_MAX_XFERS 0 \
  CONFIG.ARB_ON_TLAST 1 \
  CONFIG.M00_AXIS_HIGHTDEST 0x00000003 \
  CONFIG.M00_FIFO_DEPTH 256 \
  CONFIG.M00_FIFO_MODE 1 \
  CONFIG.M00_HAS_REGSLICE 1 \
  CONFIG.M01_AXIS_BASETDEST 0x00000000 \
  CONFIG.M01_FIFO_DEPTH 512 \
  CONFIG.M01_FIFO_MODE 1 \
  CONFIG.M01_HAS_REGSLICE 1 \
  CONFIG.NUM_MI 1 \
  CONFIG.NUM_SI 2 \
  CONFIG.S00_FIFO_DEPTH 64 \
  CONFIG.S00_FIFO_MODE 1 \
  CONFIG.S00_HAS_REGSLICE 1 \
  CONFIG.S01_FIFO_DEPTH 64 \
  CONFIG.S01_FIFO_MODE 1 \
  CONFIG.S01_HAS_REGSLICE 1 \
  CONFIG.S02_FIFO_DEPTH 512 \
  CONFIG.S02_FIFO_MODE 1 \
  CONFIG.S02_HAS_REGSLICE 1 \
] [get_bd_cells axis_interconnect_0]

# ---- hierarchy /from_MAC10_is_MAC1 ----
current_bd_instance /from_MAC10_is_MAC1
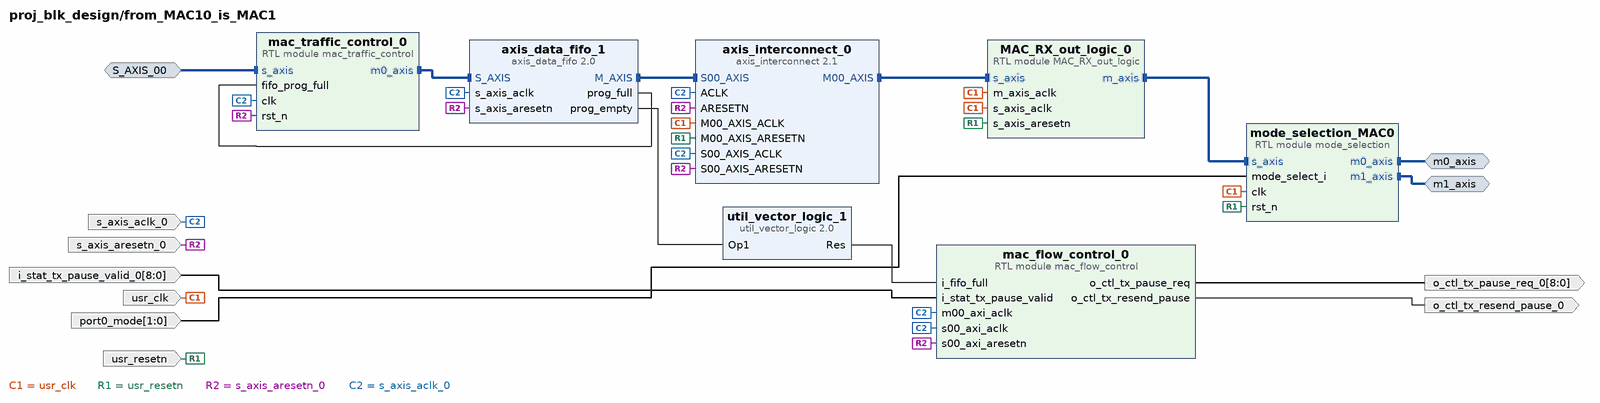
[diagram p9: block diagram inside /from_MAC10_is_MAC1]
create_bd_intf_pin -mode Slave -vlnv xilinx.com:interface:axis_rtl:1.0 S_AXIS_00
create_bd_intf_pin -mode Master -vlnv xilinx.com:interface:axis_rtl:1.0 m1_axis
create_bd_intf_pin -mode Master -vlnv xilinx.com:interface:axis_rtl:1.0 m0_axis
create_bd_pin -dir I -type clk usr_clk
create_bd_pin -dir I -type rst usr_resetn
create_bd_pin -dir I -from 8 -to 0 i_stat_tx_pause_valid_0
create_bd_pin -dir O -from 8 -to 0 o_ctl_tx_pause_req_0
create_bd_pin -dir O o_ctl_tx_resend_pause_0
create_bd_pin -dir I -type rst s_axis_aresetn_0
create_bd_pin -dir I -type clk s_axis_aclk_0
create_bd_pin -dir I -from 1 -to 0 port0_mode

create_bd_cell -type ip -vlnv xilinx.com:ip:axis_data_fifo:2.0 axis_data_fifo_1
set_property -dict [list \
  CONFIG.FIFO_DEPTH 1024 \
  CONFIG.FIFO_MODE 2 \
  CONFIG.HAS_PROG_EMPTY 1 \
  CONFIG.HAS_PROG_FULL 1 \
  CONFIG.HAS_TKEEP 1 \
  CONFIG.PROG_EMPTY_THRESH 300 \
  CONFIG.PROG_FULL_THRESH 800 \
  CONFIG.TDATA_NUM_BYTES 8 \
  CONFIG.TDEST_WIDTH 0 \
] [get_bd_cells axis_data_fifo_1]
create_bd_cell -type ip -vlnv xilinx.com:ip:util_vector_logic:2.0 util_vector_logic_1
set_property -dict {CONFIG.C_OPERATION not CONFIG.C_SIZE 1} [get_bd_cells util_vector_logic_1]
create_bd_cell -type ip -vlnv xilinx.com:ip:axis_interconnect:2.1 axis_interconnect_0
set_property -dict [list \
  CONFIG.ARB_ON_TLAST 1 \
  CONFIG.M00_AXIS_HIGHTDEST 0x00000003 \
  CONFIG.M00_FIFO_DEPTH 32 \
  CONFIG.M00_FIFO_MODE 0 \
  CONFIG.M00_HAS_REGSLICE 1 \
  CONFIG.NUM_MI 1 \
  CONFIG.S00_FIFO_DEPTH 256 \
  CONFIG.S00_FIFO_MODE 1 \
  CONFIG.S00_HAS_REGSLICE 1 \
] [get_bd_cells axis_interconnect_0]
create_bd_cell -type module -reference mac_traffic_control mac_traffic_control_0
create_bd_cell -type module -reference MAC_RX_out_logic MAC_RX_out_logic_0
set_property -dict {CONFIG.TDEST_VALUE {"01"}} [get_bd_cells MAC_RX_out_logic_0]
create_bd_cell -type module -reference mac_flow_control mac_flow_control_0
create_bd_cell -type module -reference mode_selection mode_selection_MAC0
